# Altium schematic sheet TRACTIAN_microSD.SchDoc
size A
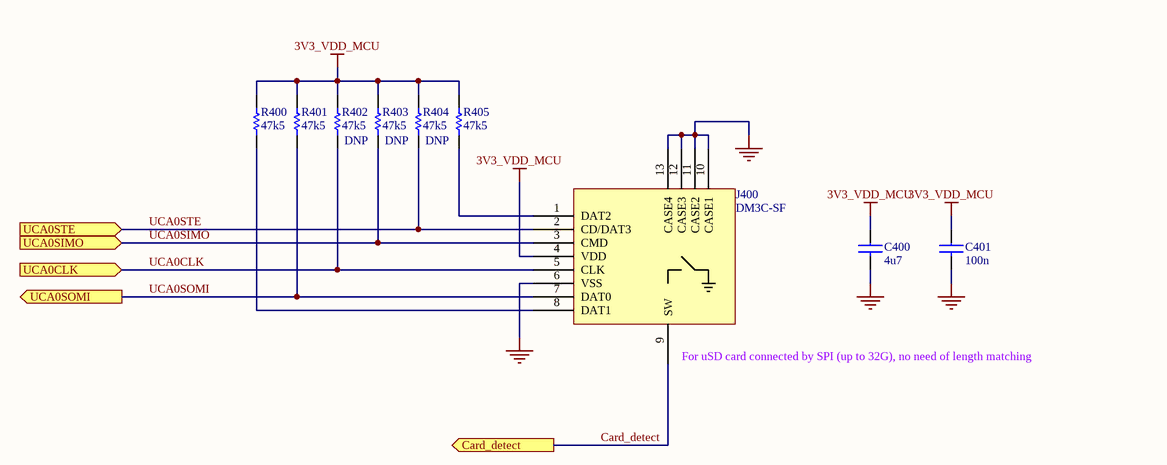
[diagram p0: TRACTIAN_microSD.SchDoc]

## Parts
C400  4u7  [C0402]
C401  100n  [C0402]
J400  DM3C-SF  [uSD_DM3CS]
R400  47k5  [R0402]
R401  47k5  [R0402]
R402  47k5  Assembly: DNP  [R0402]
R403  47k5  Assembly: DNP  [R0402]
R404  47k5  Assembly: DNP  [R0402]
R405  47k5  [R0402]

## Ports
Card_detect (out), UCA0CLK (in), UCA0SIMO (in), UCA0SOMI (out), UCA0STE (in)

## Nets
3V3_VDD_MCU: C400.1 C401.1 J400.4(VDD) R400.2 R401.2 R402.2 R403.2 R404.2 R405.2
GND: C400.2 C401.2 J400.6(VSS) J400.10(CASE1) J400.11(CASE2) J400.12(CASE3) J400.13(CASE4)
Card_detect: J400.9(SW) ; port Card_detect
UCA0CLK: J400.5(CLK) R402.1 ; port UCA0CLK
UCA0SIMO: J400.3(CMD) R403.1 ; port UCA0SIMO
UCA0SOMI: J400.7(DAT0) R401.1 ; port UCA0SOMI
UCA0STE: J400.2(CD/DAT3) R404.1 ; port UCA0STE
NetJ400_1: J400.1(DAT2) R405.1
NetJ400_8: J400.8(DAT1) R400.1

## Notes on the sheet
- (near J400) For uSD card connected by SPI (up to 32G), no need of length matching

## Library data of the parts
C400 = C1005X5R1A475M: CAP CER 4.7UF 10V 20% X5R 0402; Manufacturer: TDK Corporation; Capacitance: 4.7µF; .Checked PCB: RF; Supplier 1: Digi-Key; Supplier Part Number 1: 445-8023-1-ND; Manufacturer Part Number: C1005X5R1A475M; RoHS: RoHS Compliant; Category: Capacitors; Stock 1: 10140; Pricing 1: 1=0.53, 10=0.415, 100=0.25, 250=0.18752, 500=0.16, 1000=0.125, 5000=0.095 (USD); Voltage - Rated: 10V; Tolerance: ±20%; Temperature Coefficient: X5R; Mounting Type: Surface Mount, MLCC; Operating Temperature: -55°C ~ 85°C; Applications: General Purpose; Ratings: -; Package / Case: 0402 (1005 Metric); Size / Dimension: 0.039" L x 0.020" W (1.00mm x 0.50mm); Height - Seated (Max): -; Thickness (Max): -; Lead Spacing: -; Features: -; Packaging: Cut Tape (CT); Lead Style: -; ComponentLink1URL: http://www.tdk.com/pdf/general_B11.pdf; ComponentLink1Description: http://www.tdk.com/pdf/general_B11.pdf; .Checked SCH: RF
C401 = C1005X5R1H104K: CAP CER .10UF 50V X5R 10% 0402; Manufacturer: TDK Corporation; Capacitance: 0.1µF; Value: 100nF; .Checked PCB: used; Category: Capacitors; Supplier Part Number: 445-5942-1-ND; Manufacturer Part Number: C1005X5R1H104K; Operating Temperature: -55°C ~ 85°C; Package / Case: 0402 (1005 Metric); Price 1k [$]: 0.02340; .Checked SCH: used; Voltage - Rated: 50V; Supplier: Digikey; Supplier 1: Digi-Key; Supplier Part Number 1: 445-5942-1-ND; RoHS: RoHS Compliant; Stock 1: 106926; Pricing 1: 1=0.27, 10=0.18, 100=0.072, 250=0.05176, 500=0.0369, 1000=0.027 (USD); Tolerance: ±10%; Temperature Coefficient: X5R; Mounting Type: Surface Mount, MLCC; Applications: General Purpose; Ratings: -; Size / Dimension: 0.039" L x 0.020" W (1.00mm x 0.50mm); Height - Seated (Max): -; Thickness (Max): 0.022" (0.55mm); Lead Spacing: -; Features: -; Packaging: Cut Tape (CT); Lead Style: -; ComponentLink1URL: http://www.tdk.co.jp/tefe02/e412_c.pdf; ComponentLink1Description: http://www.tdk.co.jp/tefe02/e412_c.pdf
J400 = DM3C-SF: CONN MICRO SD R/A HING TYPE SMD; Manufacturer: Hirose Electric Co Ltd; Card Type: Secure Digital - microSD™; Number of Positions: 10 (8 + 2); Connector Type: Connector and Ejector; Insertion, Removal Method: Hinged Lid; .Creator: MM; Supplier 1: Digi-Key; Manufacturer Part Number: DM3C-SF; RoHS: RoHS Compliant; Category: Connectors, Interconnects; Stock 1: 87; Pricing 1: 1=2.36, 10=1.96, 25=1.8152, 50=1.6368, 100=1.452, 250=1.2738, 500=1.1616 (USD); Packaging: Cut Tape (CT); Ejector Side: -; Mounting Type: Surface Mount, Right Angle; Features: Switch; Height Above Board: 0.072" (1.83mm); Mounting Feature: Normal, Standard - Top; Contact Finish: Gold; Contact Finish Thickness: -; ComponentLink1URL: http://www.hirose.co.jp/cataloge_hp/e60900232.pdf; ComponentLink1Description: http://www.hirose.co.jp/cataloge_hp/e60900232.pdf; Supplier Part Number 1: HR1940CT-ND; .Checked PCB: MM; .Checked SCH: MM
R400-R405 = RC0402FR-0747K5L: RES 47.5K OHM 1/16W 1% 0402 SMD; Manufacturer: Yageo; Power (Watts): 0.063W, 1/16W; Temperature Coefficient: ±100ppm/°C; .Checked PCB: RF; Supplier 1: Digi-Key; Supplier Part Number 1: 311-47.5KLRCT-ND; Manufacturer Part Number: RC0402FR-0747K5L; RoHS: RoHS Compliant; Category: Resistors; Stock 1: 59607; Pricing 1: 10=0.014, 100=0.0063, 500=0.00382, 1000=0.0027, 5000=0.00203 (USD); Resistance (Ohms): 47.5K; Composition: Thick Film; Features: -; Tolerance: ±1%; Package / Case: 0402 (1005 Metric); Size / Dimension: 0.039" L x 0.020" W (1.00mm x 0.50mm); Height: 0.016" (0.40mm); Number of Terminations: 2; Packaging: Cut Tape (CT); ComponentLink1URL: http://www.yageo.com/documents/recent/PYu-RC0402_51_RoHS_L_6.pdf; ComponentLink1Description: http://www.yageo.com/documents/recent/PYu-RC0402_51_RoHS_L_6.pdf; .Checked SCH: RF
  R400 R401 R405: Assembly: *